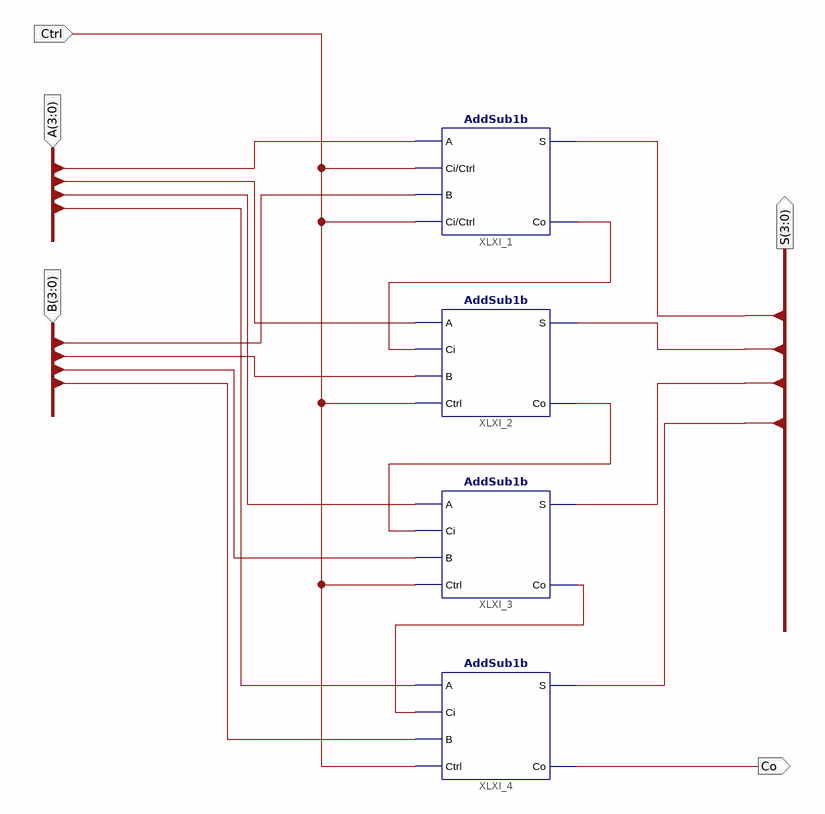
[diagram p0: schematic sheet 1]
// Xilinx ISE schematic AddSub4b.sch (kintex7) as structural Verilog: 4 symbols, 5 ports
module AddSub4b (
  input  Ctrl,
  input  [3:0] A,
  input  [3:0] B,
  output [3:0] S,
  output Co
);

  wire XLXN_6, XLXN_7, XLXN_9;

  AddSub1b XLXI_1 (.A(A[0]), .Ci(Ctrl), .B(B[0]), .Ctrl(Ctrl), .S(S[0]), .Co(XLXN_6));
  AddSub1b XLXI_2 (.A(A[1]), .Ci(XLXN_6), .B(B[1]), .Ctrl(Ctrl), .S(S[1]), .Co(XLXN_7));
  AddSub1b XLXI_3 (.A(A[2]), .Ci(XLXN_7), .B(B[2]), .Ctrl(Ctrl), .S(S[2]), .Co(XLXN_9));
  AddSub1b XLXI_4 (.A(A[3]), .Ci(XLXN_9), .B(B[3]), .Ctrl(Ctrl), .S(S[3]), .Co(Co));
endmodule
